# EAGLE design xhfc-breakout (EAGLE 7.7.0)
REVISION: v1

## Sheet 1 of 2
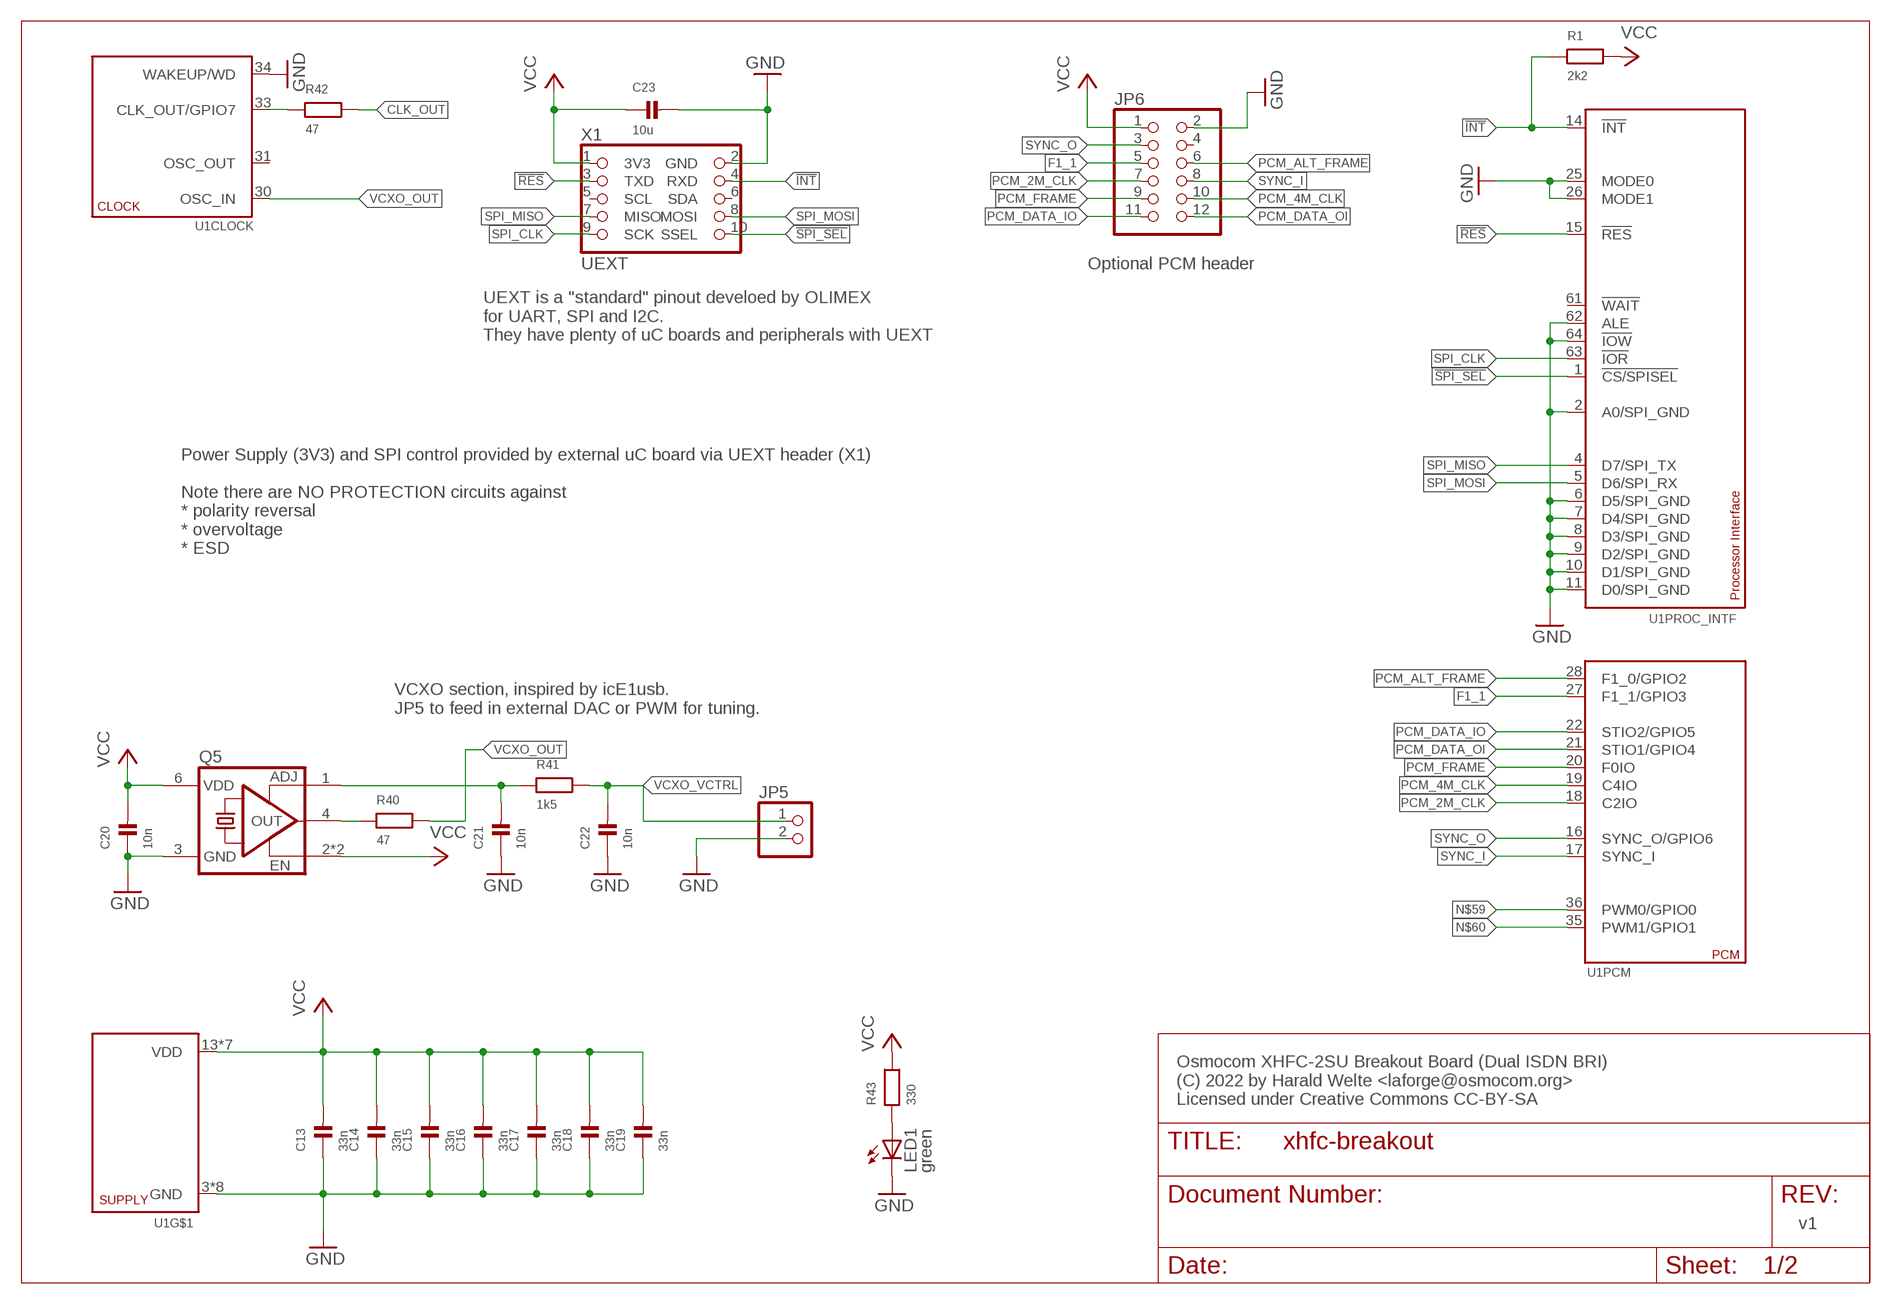
[diagram p0: schematic, sheet 1]

### Parts
C13  33n  CAP_CERAMIC_0603  [_0603]
C14  33n  CAP_CERAMIC_0603  [_0603]
C15  33n  CAP_CERAMIC_0603  [_0603]
C16  33n  CAP_CERAMIC_0603  [_0603]
C17  33n  CAP_CERAMIC_0603  [_0603]
C18  33n  CAP_CERAMIC_0603  [_0603]
C19  33n  CAP_CERAMIC_0603  [_0603]
C20  10n  CAP_CERAMIC_0603  [_0603]
C21  10n  CAP_CERAMIC_0603  [_0603]
C22  10n  CAP_CERAMIC_0603  [_0603]
C23  10u  CAP_CERAMIC1206  [1206]
JP5  PINHD-1X2  [1X02]
JP6  PINHD-2X6  [2X06]
LED1  green  LEDCHIP-LED0603  [CHIP-LED0603]
Q5  VCXO-EN-VKB  [VKB]
R1  2k2  RESISTOR_0603  [_0603]
R40  47  RESISTOR_0603  [_0603]
R41  1k5  RESISTOR_0603  [_0603]
R42  47  RESISTOR_0603  [_0603]
R43  330  RESISTOR_0603  [_0603]
U1  XHFC-2SU  [LQFP64]
X1  UEXT  [2X05]

### Nets
!INT: R1.1 U1.14(PROC_INTF:!INT) X1.4(RXD)
!RES: U1.15(PROC_INTF:!RES) X1.3(TXD)
!SPI_SEL: U1.1(PROC_INTF:!CS/SPISEL) X1.10(SSEL)
CLK_OUT: R42.2
F1_1: JP6.5 U1.27(PCM:F1_1/GPIO3)
GND: C13.1 C14.1 C15.1 C16.1 C17.1 C18.1 C19.1 C20.1 C21.1 C22.1 C23.2 JP5.2 JP6.2 LED1.C Q5.3(GND) U1.2(PROC_INTF:A0/SPI_GND) U1.3(GND) U1.6(PROC_INTF:D5/SPI_GND) U1.7(PROC_INTF:D4/SPI_GND) U1.8(PROC_INTF:D3/SPI_GND) U1.9(PROC_INTF:D2/SPI_GND) U1.10(PROC_INTF:D1/SPI_GND) U1.11(PROC_INTF:D0/SPI_GND) U1.12(GND) U1.23(GND) U1.25(PROC_INTF:MODE0) U1.26(PROC_INTF:MODE1) U1.32(GND) U1.34(CLOCK:WAKEUP/WD) U1.38(GND) U1.45(GND) U1.52(GND) U1.59(GND) U1.62(PROC_INTF:ALE) U1.64(PROC_INTF:!IOW) X1.2(GND) ; also sheet 2
N$2: LED1.A R43.1
N$59: U1.36(PCM:PWM0/GPIO0)
N$60: U1.35(PCM:PWM1/GPIO1)
N$62: C21.2 Q5.1(ADJ) R41.1
N$63: R42.1 U1.33(CLOCK:CLK_OUT/GPIO7)
N$64: Q5.4(OUT) R40.1
PCM_2M_CLK: JP6.7 U1.18(PCM:C2IO)
PCM_4M_CLK: JP6.10 U1.19(PCM:C4IO)
PCM_ALT_FRAME: JP6.6 U1.28(PCM:F1_0/GPIO2)
PCM_DATA_IO: JP6.11 U1.22(PCM:STIO2/GPIO5)
PCM_DATA_OI: JP6.12 U1.21(PCM:STIO1/GPIO4)
PCM_FRAME: JP6.9 U1.20(PCM:F0IO)
SPI_CLK: U1.63(PROC_INTF:!IOR) X1.9(SCK)
SPI_MISO: U1.4(PROC_INTF:D7/SPI_TX) X1.7(MISO)
SPI_MOSI: U1.5(PROC_INTF:D6/SPI_RX) X1.8(MOSI)
SYNC_I: JP6.8 U1.17(PCM:SYNC_I)
SYNC_O: JP6.3 U1.16(PCM:SYNC_O/GPIO6)
VCC: C13.2 C14.2 C15.2 C16.2 C17.2 C18.2 C19.2 C20.2 C23.1 JP6.1 Q5.2(EN) Q5.5(EN) Q5.6(VDD) R1.2 R43.2 U1.13(VDD) U1.24(VDD) U1.29(VDD) U1.37(VDD) U1.44(VDD) U1.53(VDD) U1.60(VDD) X1.1(3V3) ; also sheet 2
VCXO_OUT: R40.2 U1.30(CLOCK:OSC_IN)
VCXO_VCTRL: C22.2 JP5.1 R41.2
Unconnected: JP6.4 U1.31(CLOCK:OSC_OUT) U1.61(PROC_INTF:!WAIT) X1.5(SCL) X1.6(SDA)

### Notes on the sheet
- Optional PCM header
- UEXT is a "standard" pinout develoed by OLIMEX
  for UART, SPI and I2C.
  They have plenty of uC boards and peripherals with UEXT
- Power Supply (3V3) and SPI control provided by external uC board via UEXT header (X1)
  
  Note there are NO PROTECTION circuits against
  * polarity reversal
  * overvoltage
  * ESD
- VCXO section, inspired by icE1usb.
  JP5 to feed in external DAC or PWM for tuning.
- Osmocom XHFC-2SU Breakout Board (Dual ISDN BRI)
  (C) 2022 by Harald Welte <laforge@osmocom.org>
  Licensed under Creative Commons CC-BY-SA

## Sheet 2 of 2
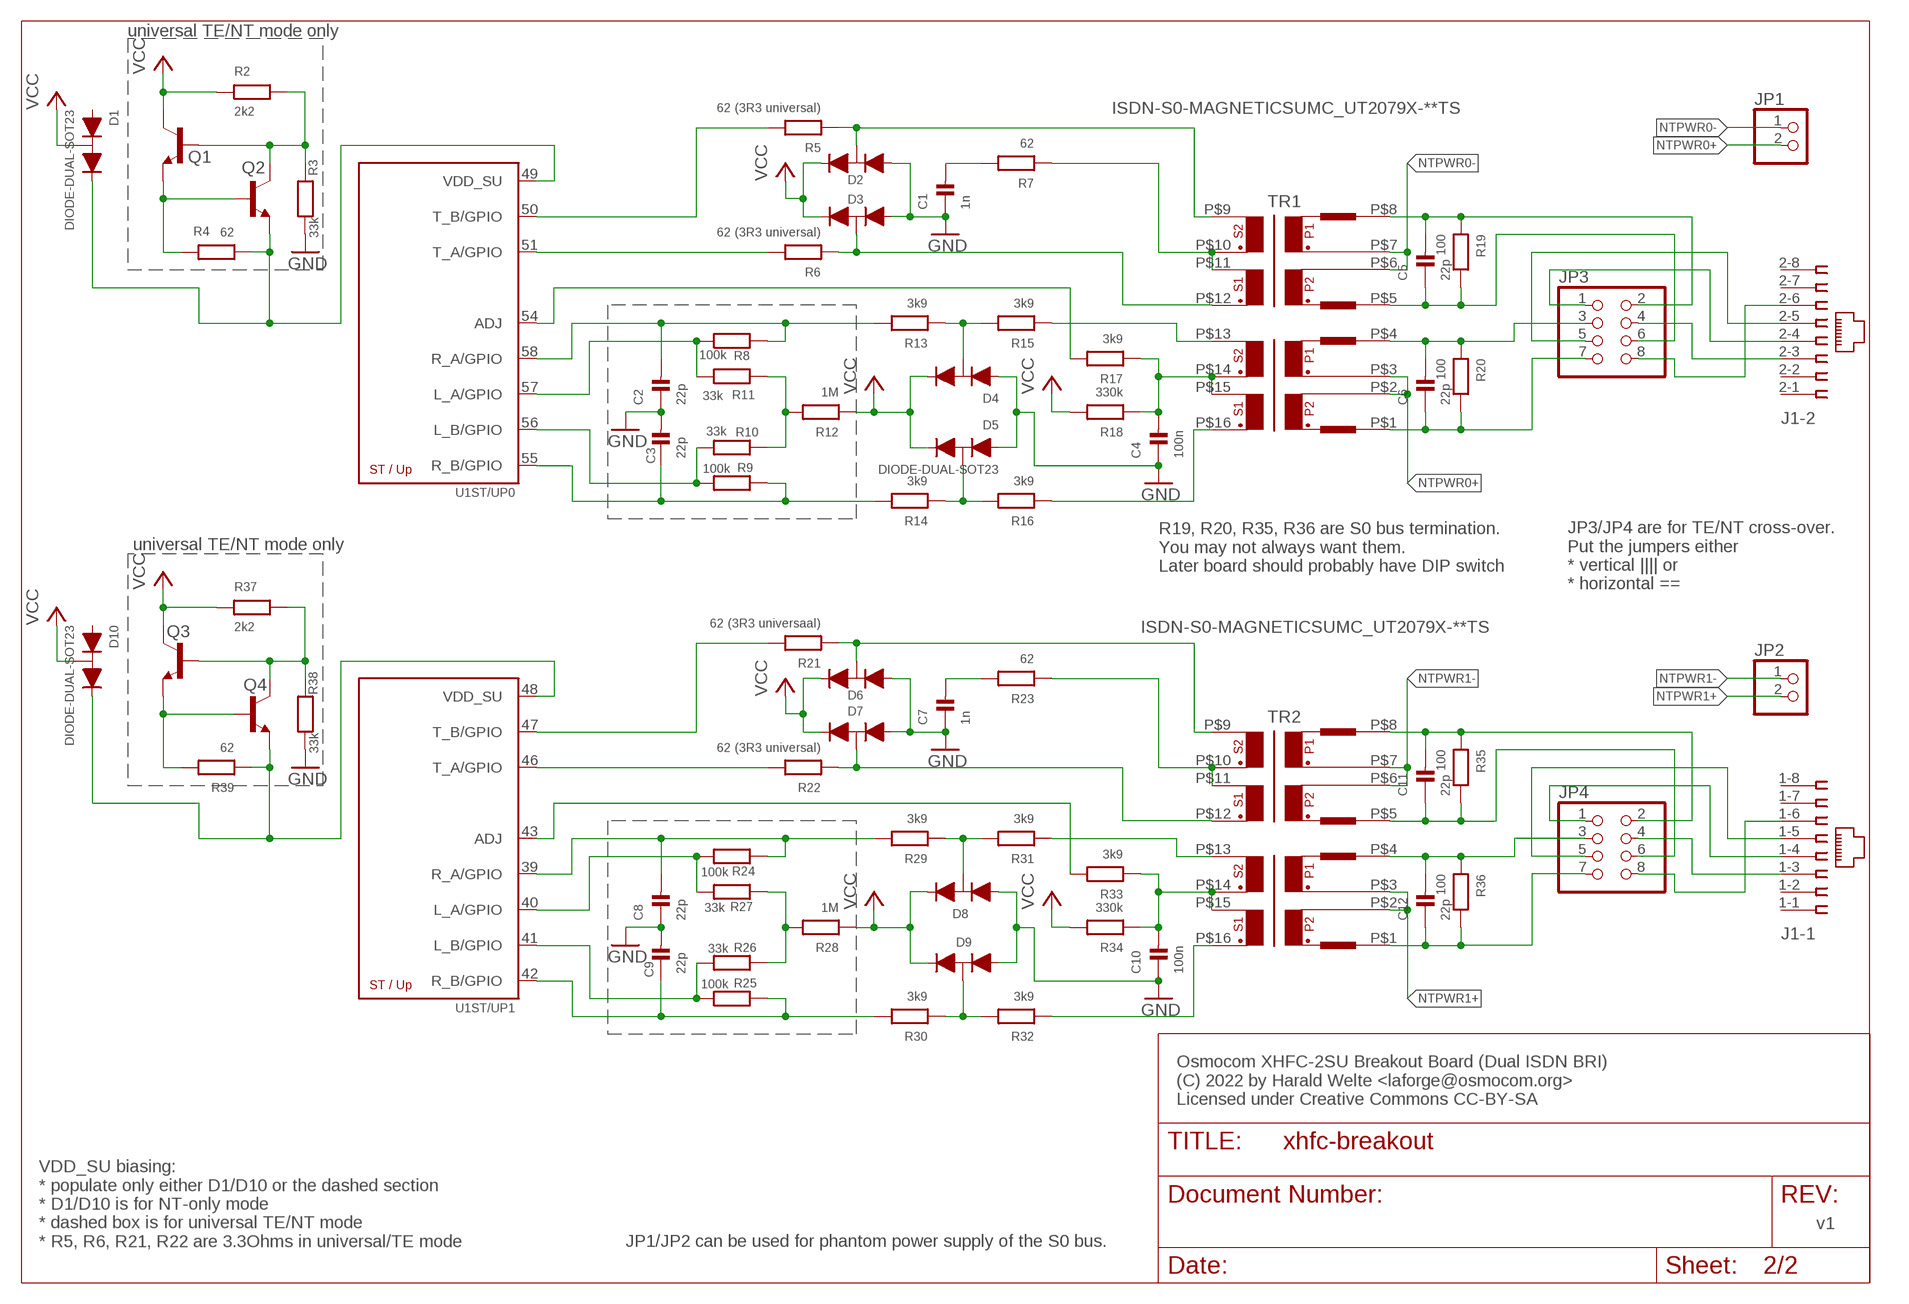
[diagram p1: schematic, sheet 2]

### Parts
C1  1n  CAP_CERAMIC_0603  [_0603]
C2  22p  CAP_CERAMIC_0603  [_0603]
C3  22p  CAP_CERAMIC_0603  [_0603]
C4  100n  CAP_CERAMIC_0603  [_0603]
C5  22p  CAP_CERAMIC_0603  [_0603]
C6  22p  CAP_CERAMIC_0603  [_0603]
C7  1n  CAP_CERAMIC_0603  [_0603]
C8  22p  CAP_CERAMIC_0603  [_0603]
C9  22p  CAP_CERAMIC_0603  [_0603]
C10  100n  CAP_CERAMIC_0603  [_0603]
C11  22p  CAP_CERAMIC_0603  [_0603]
C12  22p  CAP_CERAMIC_0603  [_0603]
D1  DIODE-DUAL-SOT23  [SOT23-3]
D2  DIODE-DUAL-SOT23  [SOT23-3]
D3  DIODE-DUAL-SOT23  [SOT23-3]
D4  DIODE-DUAL-SOT23  [SOT23-3]
D5  DIODE-DUAL-SOT23  [SOT23-3]
D6  DIODE-DUAL-SOT23  [SOT23-3]
D7  DIODE-DUAL-SOT23  [SOT23-3]
D8  DIODE-DUAL-SOT23  [SOT23-3]
D9  DIODE-DUAL-SOT23  [SOT23-3]
D10  DIODE-DUAL-SOT23  [SOT23-3]
J1  557560-1  [557560-1]
JP1  PINHD-1X2  [1X02]
JP2  PINHD-1X2  [1X02]
JP3  PINHD-2X4  [2X04]
JP4  PINHD-2X4  [2X04]
Q1  BC848CSMD  [SOT23]
Q2  BC848CSMD  [SOT23]
Q3  BC848CSMD  [SOT23]
Q4  BC848CSMD  [SOT23]
R2  2k2  RESISTOR_0603  [_0603]
R3  33k  RESISTOR_0603  [_0603]
R4  62  RESISTOR_0603  [_0603]
R5  62 (3R3 universal)  RESISTOR_0603  [_0603]
R6  62 (3R3 universal)  RESISTOR_0603  [_0603]
R7  62  RESISTOR_0603  [_0603]
R8  100k  RESISTOR_0603  [_0603]
R9  100k  RESISTOR_0603  [_0603]
R10  33k  RESISTOR_0603  [_0603]
R11  33k  RESISTOR_0603  [_0603]
R12  1M  RESISTOR_0603  [_0603]
R13  3k9  RESISTOR_0603  [_0603]
R14  3k9  RESISTOR_0603  [_0603]
R15  3k9  RESISTOR_0603  [_0603]
R16  3k9  RESISTOR_0603  [_0603]
R17  3k9  RESISTOR_0603  [_0603]
R18  330k  RESISTOR_0603  [_0603]
R19  100  RESISTOR_0603  [_0603]
R20  100  RESISTOR_0603  [_0603]
R21  62 (3R3 universaal)  RESISTOR_0603  [_0603]
R22  62 (3R3 universal)  RESISTOR_0603  [_0603]
R23  62  RESISTOR_0603  [_0603]
R24  100k  RESISTOR_0603  [_0603]
R25  100k  RESISTOR_0603  [_0603]
R26  33k  RESISTOR_0603  [_0603]
R27  33k  RESISTOR_0603  [_0603]
R28  1M  RESISTOR_0603  [_0603]
R29  3k9  RESISTOR_0603  [_0603]
R30  3k9  RESISTOR_0603  [_0603]
R31  3k9  RESISTOR_0603  [_0603]
R32  3k9  RESISTOR_0603  [_0603]
R33  3k9  RESISTOR_0603  [_0603]
R34  330k  RESISTOR_0603  [_0603]
R35  100  RESISTOR_0603  [_0603]
R36  100  RESISTOR_0603  [_0603]
R37  2k2  RESISTOR_0603  [_0603]
R38  33k  RESISTOR_0603  [_0603]
R39  62  RESISTOR_0603  [_0603]
TR1  ISDN-S0-MAGNETICSUMC_UT2079X-**TS  [UMEC_UT207]
TR2  ISDN-S0-MAGNETICSUMC_UT2079X-**TS  [UMEC_UT207]

### Nets
GND: C1.1 C2.1 C3.2 C4.1 C7.1 C8.1 C9.2 C10.1 D2.1(A) D3.1(A) D4.1(A) D5.1(A) D6.1(A) D7.1(A) D8.1(A) D9.1(A) R3.1 R38.1 ; also sheet 1
N$1: Q1.1(B) Q2.3(C) R2.2 R3.2
N$3: Q1.2(E) Q2.1(B) R4.2
N$6: D2.3(M) R5.1 TR1.P$9
N$7: D3.3(M) R6.1 TR1.P$12
N$8: J1.2-4 JP3.1
N$9: C1.2 R7.2
N$10: R7.1 TR1.P$10 TR1.P$11
N$16: R10.1 R11.1 R12.2
N$17: D6.3(M) R21.1 TR2.P$9
N$18: C5.2 JP3.2 R19.1 TR1.P$8
N$19: D4.3(M) R13.1 R15.2
N$20: D5.3(M) R14.1 R16.2
N$21: C5.1 JP3.6 R19.2 TR1.P$5
N$22: R15.1 TR1.P$13
N$23: R16.1 TR1.P$16
N$24: C4.2 R17.1 R18.1 TR1.P$14 TR1.P$15
N$25: J1.2-5 JP3.5
N$26: C6.1 JP3.7 R20.2 TR1.P$1
N$27: D7.3(M) R22.1 TR2.P$12
N$30: C7.2 R23.2
N$31: R23.1 TR2.P$10 TR2.P$11
N$37: R26.1 R27.1 R28.2
N$38: D8.3(M) R29.1 R31.2
N$39: D9.3(M) R30.1 R32.2
N$40: R31.1 TR2.P$13
N$41: R32.1 TR2.P$16
N$42: C10.2 R33.1 R34.1 TR2.P$14 TR2.P$15
N$43: C11.2 JP4.2 R35.1 TR2.P$8
N$44: C11.1 JP4.6 R35.2 TR2.P$5
N$45: C12.2 JP4.3 R36.1 TR2.P$4
N$46: C12.1 JP4.7 R36.2 TR2.P$1
N$47: Q3.1(B) Q4.3(C) R37.2 R38.2
N$48: Q3.2(E) Q4.1(B) R39.2
N$50: C6.2 JP3.3 R20.1 TR1.P$4
N$52: J1.2-3 JP3.4
N$53: J1.2-6 JP3.8
N$54: J1.1-4 JP4.1
N$55: J1.1-5 JP4.5
N$56: J1.1-3 JP4.4
N$61: J1.1-6 JP4.8
NTPWR0+: JP1.2 TR1.P$2 TR1.P$3
NTPWR0-: JP1.1 TR1.P$6 TR1.P$7
NTPWR1+: JP2.2 TR2.P$2 TR2.P$3
NTPWR1-: JP2.1 TR2.P$6 TR2.P$7
P0_ADJ: R17.2 U1.54(ST/UP0:ADJ)
P0_L_A: R8.2 R11.2 U1.57(ST/UP0:L_A/GPIO)
P0_L_B: R9.2 R10.2 U1.56(ST/UP0:L_B/GPIO)
P0_R_A: C2.2 R8.1 R13.2 U1.58(ST/UP0:R_A/GPIO)
P0_R_B: C3.1 R9.1 R14.2 U1.55(ST/UP0:R_B/GPIO)
P0_T_A: R6.2 U1.51(ST/UP0:T_A/GPIO)
P0_T_B: R5.2 U1.50(ST/UP0:T_B/GPIO)
P0_VDD_SU: D1.2(C) Q2.2(E) R4.1 U1.49(ST/UP0:VDD_SU)
P1_ADJ: R33.2 U1.43(ST/UP1:ADJ)
P1_L_A: R24.2 R27.2 U1.40(ST/UP1:L_A/GPIO)
P1_L_B: R25.2 R26.2 U1.41(ST/UP1:L_B/GPIO)
P1_R_A: C8.2 R24.1 R29.2 U1.39(ST/UP1:R_A/GPIO)
P1_R_B: C9.1 R25.1 R30.2 U1.42(ST/UP1:R_B/GPIO)
P1_T_A: R22.2 U1.46(ST/UP1:T_A/GPIO)
P1_T_B: R21.2 U1.47(ST/UP1:T_B/GPIO)
P1_VDD_SU: D10.2(C) Q4.2(E) R39.1 U1.48(ST/UP1:VDD_SU)
VCC: D1.3(M) D2.2(C) D3.2(C) D4.2(C) D5.2(C) D6.2(C) D7.2(C) D8.2(C) D9.2(C) D10.3(M) Q1.3(C) Q3.3(C) R2.1 R12.1 R18.2 R28.1 R34.2 R37.1 ; also sheet 1
Unconnected: D1.1(A) D10.1(A) J1.1-1 J1.1-2 J1.1-7 J1.1-8 J1.2-1 J1.2-2 J1.2-7 J1.2-8

### Notes on the sheet
- universal TE/NT mode only
- universal TE/NT mode only
- R19, R20, R35, R36 are S0 bus termination.
  You may not always want them.
  Later board should probably have DIP switch
- JP3/JP4 are for TE/NT cross-over.
  Put the jumpers either
  * vertical |||| or
  * horizontal ==
- Osmocom XHFC-2SU Breakout Board (Dual ISDN BRI)
  (C) 2022 by Harald Welte <laforge@osmocom.org>
  Licensed under Creative Commons CC-BY-SA
- VDD_SU biasing:
  * populate only either D1/D10 or the dashed section
  * D1/D10 is for NT-only mode
  * dashed box is for universal TE/NT mode
  * R5, R6, R21, R22 are 3.3Ohms in universal/TE mode
- JP1/JP2 can be used for phantom power supply of the S0 bus.

## Library data of the parts
C1-C23 = rc-sysmocom:CAP_CERAMIC: Ceramic Capacitors 0402 - 0402 Surface Mount Capacitors 16pF 50V 5% [Digikey: 445-4899-2-ND] 18pF 50V 5% [Digikey: 490-1281-2-ND] 22pF 50V 5% [Digikey: 490-1283-2-ND] 68pF 50V 5% [Digikey: 490-1289-2-ND] 0.1uF 10V 10% [Digikey: 490-1318-2-ND] 1.0uF 6.3V 10% [Digikey: 490-1320-2-ND] 0603 - 0603 Surface Mount Capacitors 16 pF 50V 5% [Digikey: 445-5051-2-ND] 22 pF 50V [Digikey: PCC220ACVTR-ND] 33 pF 50V 5% [Digikey: 490-1415-1-ND] 56pF 50V 5% [Digikey: 490-1421-1-ND] 220pF 50V 5% [Digikey: 445-1285-1-ND] 680 pF 50V 2200 pF 50V 5% C0G [Digikey: 445-1297-1-ND] 5600 pF 100V 5% X7R [Digikey: 478-3711-1-ND] 0.1 µF 25V 10% [Digikey: PCC2277TR-ND] 0.22 µF 16V 10% X7R [Digikey: 445-1318-1-ND] 1.0 µF 25V 10% [Digikey: 445-5146-2-ND] 0603 - RF Specific 3pF 250V +/-0.1pF RF [Digikey: 712-1347-1-ND] 18 pF 250V 5% [Digikey: 478-3505-1-ND or 712-1322-1-ND] 56 pF 250V 5% C0G RF [Digikey: 490-4867-1-ND] 68 pF 250V RF [Digikey: 490-4868-1-ND] 0805 - 0805 Surface Mount Capacitors 220 pF 250V 2% RF Ceramic Capacitor [Digikey: 712-1398-1-ND] 1000 pF 50V 2% NP0 Ceramic Capacitor [Digikey: 478-3760-1-ND] 0.1 µF 25V 10% Ceramic Capacitor [Digikey: PCC1828TR-ND] 1.0 µF 16V 10% Ceramic Capacitor[Digikey: 490-1691-2-ND] 10.0 µF 10V 10% Ceramic Capacitor[Digikey: 709-1228-1-ND] 10.0 uF 16V 10% Ceramic Capacitor [Digikey: 478-5165-2-ND] 47 uF 6.3V 20% Ceramic Capacitor [Digikey: 587-1779-1-ND or 399-5506-1-ND] 1206 - 1206 Surface Mount Capacitors 47uF 10V 20% Ceramic Capacitor [Digikey: 490-5528-1-ND or 399-5508-1-ND or 445-6010-1-ND] 100uF 6.3V -20%, +80% Y5V Ceramic Capacitor (Digikey: 490-4512-1-ND, Mouser: 81-GRM31CF50J107ZE1L) 1810 - 1810 Surface Mount Capacitors High volt MLC; no solder stop between for higher isolation; CLASS: CAPACITOR; DESCRIPTION: NO DESCRIPTION; LINK: UNKNOWN LINK; MANUFACTURER: UNKNOWN MANUFACTURER; MANUFACTURERPARTNUMBER: UNKNOWN MANUFACTURER PART NUMBER; POPULATED: TRUE; ROHSCERTIFICATE: UNKNOWN ROHS CERTIFICATE; SOURCE: UNKNOWN SOURCE; SOURCEPARTNUMBER: UNKNOWN SOURCE PART NUMBER
D1-D10 = diodes-sysmocom:DIODE-DUAL; CLASS: DIODE; DATASHEET: https://assets.nexperia.com/documents/data-sheet/BAV99_SER.pdf; DESCRIPTION: DIODE ARRAY GP 100V 150MA SOT323; LINK: https://www.digikey.com/en/products/detail/nexperia-usa-inc/BAV99W-115/763229; MANUFACTURER: Nexperia USA Inc.; MANUFACTURERPARTNUMBER: BAV99W,115; POPULATED: TRUE; ROHSCERTIFICATE: ROHS3 Compliant; SOURCE: DIGIKEY; SOURCEPARTNUMBER: 1727-2915-6-ND
J1 = con-amp:557560-1: AMP connector; CLASS: CONNECTOR\JUMPER; DATASHEET: https://www.te.com/commerce/DocumentDelivery/DDEController?Action=srchrtrv&DocNm=5557560&DocType=Customer+Drawing&DocLang=English; DESCRIPTION: CONN MOD JACK 8P8C R/A UNSHLD; LINK: https://www.digikey.com/en/products/detail/te-connectivity-amp-connectors/5557560-1/769593; MANUFACTURER: TE Connectivity AMP Connectors; MANUFACTURERPARTNUMBER: 5557560-1; POPULATED: TRUE; ROHSCERTIFICATE: RoHS Compliant; SOURCE: DIGIKEY; SOURCEPARTNUMBER: A31449-ND
JP1 JP2 JP5 = laforge:PINHD-1X2: PIN HEADER; CLASS: CONNECTOR\JUMPER; DESCRIPTION: NO DESCRIPTION; LINK: UNKNOWN LINK; MANUFACTURER: UNKNOWN MANUFACTURER; MANUFACTURERPARTNUMBER: UNKNOWN MANUFACTURER PART NUMBER; POPULATED: TRUE; ROHSCERTIFICATE: UNKNOWN ROHS CERTIFICATE; SOURCE: UNKNOWN SOURCE; SOURCEPARTNUMBER: UNKNOWN SOURCE PART NUMBER
JP3 JP4 = pinhead:PINHD-2X4: PIN HEADER; CLASS: CONNECTOR\JUMPER; DESCRIPTION: NO DESCRIPTION; LINK: UNKNOWN LINK; MANUFACTURER: UNKNOWN MANUFACTURER; MANUFACTURERPARTNUMBER: UNKNOWN MANUFACTURER PART NUMBER; POPULATED: TRUE; ROHSCERTIFICATE: UNKNOWN ROHS CERTIFICATE; SOURCE: UNKNOWN SOURCE; SOURCEPARTNUMBER: UNKNOWN SOURCE PART NUMBER
JP6 = pinhead:PINHD-2X6: PIN HEADER; CLASS: CONNECTOR\JUMPER; DESCRIPTION: NO DESCRIPTION; LINK: UNKNOWN LINK; MANUFACTURER: UNKNOWN MANUFACTURER; MANUFACTURERPARTNUMBER: UNKNOWN MANUFACTURER PART NUMBER; POPULATED: TRUE; ROHSCERTIFICATE: UNKNOWN ROHS CERTIFICATE; SOURCE: UNKNOWN SOURCE; SOURCEPARTNUMBER: UNKNOWN SOURCE PART NUMBER
LED1 = led:LED: LED OSRAM: - CHIPLED LG R971, LG N971, LY N971, LG Q971, LY Q971, LO R971, LY R971 LH N974, LH R974 LS Q976, LO Q976, LY Q976 LO Q996 - Hyper CHIPLED LW Q18S LB Q993, LB Q99A, LB R99A - SideLED LS A670, LO A670, LY A670, LG A670, LP A670 LB A673, LV A673, LT A673, LW A673 LH A674 LY A675 LS A676, LA A676, LO A676, LY A676, LW A676 LS A679, LY A679, LG A679 - Hyper Micro SIDELED® LS Y876, LA Y876, LO Y876, LY Y876 LT Y87S - SmartLED LW L88C, LW L88S LB L89C, LB L89S, LG L890 LS L89K, LO L89K, LY L89K LS L896, LA L896, LO L896, LY L896 - TOPLED LS T670, LO T670, LY T670, LG T670, LP T670 LSG T670, LSP T670, LSY T670, LOP T670, LYG T670 LG T671, LOG T671, LSG T671 LB T673, LV T673, LT T673, LW T673 LH T674 LS T676, LA T676, LO T676, LY T676, LB T676, LH T676, LSB T676, LW T676 LB T67C, LV T67C, LT T67C, LS T67K, LO T67K, LY T67K, LW E67C LS E67B, LA E67B, LO E67B, LY E67B, LB E67C, LV E67C, LT E67C LW T67C LS T679, LY T679, LG T679 LS T770, LO T770, LY T770, LG T770, LP T770 LB T773, LV T773, LT T773, LW T773 LH T774 LS E675, LA E675, LY E675, LS T675 LS T776, LA T776, LO T776, LY T776, LB T776 LHGB T686 LT T68C, LB T68C - Hyper Mini TOPLED® LB M676 - Mini TOPLED Santana® LG M470 LS M47K, LO M47K, LY M47K Source: http://www.osram.convergy.de LUXEON: - LUMILED® LXK2-PW12-R00, LXK2-PW12-S00, LXK2-PW14-U00, LXK2-PW14-V00 LXK2-PM12-R00, LXK2-PM12-S00, LXK2-PM14-U00 LXK2-PE12-Q00, LXK2-PE12-R00, LXK2-PE12-S00, LXK2-PE14-T00, LXK2-PE14-U00 LXK2-PB12-K00, LXK2-PB12-L00, LXK2-PB12-M00, LXK2-PB14-N00, LXK2-PB14-P00, LXK2-PB14-Q00 LXK2-PR12-L00, LXK2-PR12-M00, LXK2-PR14-Q00, LXK2-PR14-R00 LXK2-PD12-Q00, LXK2-PD12-R00, LXK2-PD12-S00 LXK2-PH12-R00, LXK2-PH12-S00 LXK2-PL12-P00, LXK2-PL12-Q00, LXK2-PL12-R00 Source: www.luxeon.com KINGBRIGHT: KA-3528ASYC Source: www.kingbright.com; CLASS: LED; DESCRIPTION: NO DESCRIPTION; LINK: UNKNOWN LINK; MANUFACTURER: UNKNOWN MANUFACTURER; MANUFACTURERPARTNUMBER: UNKNOWN MANUFACTURER PART NUMBER; POPULATED: TRUE; ROHSCERTIFICATE: UNKNOWN ROHS CERTIFICATE; SOURCE: UNKNOWN SOURCE; SOURCEPARTNUMBER: UNKNOWN SOURCE PART NUMBER
Q1-Q4 = transistor-npn:BC848*: NPN Transistor; CLASS: TRANSISTOR\MOSFET; DATASHEET: https://www.onsemi.com/pdf/datasheet/bc846awt1-d.pdf; DESCRIPTION: TRANS NPN 30V 100MA SC70-3; LINK: https://www.digikey.com/en/products/detail/onsemi/BC848CWT1G/1476045; MANUFACTURER: onsemi; MANUFACTURERPARTNUMBER: BC848CWT1G; POPULATED: TRUE; ROHSCERTIFICATE: ROHS3 Compliant; SOURCE: DIGIKEY; SOURCEPARTNUMBER: BC848CWT1GOSDKR-ND
Q5 = tcxo:VCXO-EN: VCXO with Enable pin; CLASS: TRANSISTOR\MOSFET; DATASHEET: https://www.conwin.com/datasheets/vx/vx604.pdf; DESCRIPTION: XTAL OSC VCXO 24.5760MHZ LVCMOS; LINK: https://www.digikey.com/en/products/detail/connor-winfield/VKB51B2-024-576M/7927885; MANUFACTURER: Connor Winfield; MANUFACTURERPARTNUMBER: VKB51B2-024.576M; POPULATED: TRUE; ROHSCERTIFICATE: ROHS3 Compliant; SOURCE: DIGIKEY; SOURCEPARTNUMBER: CW967CT-ND
R1-R43 = rc-sysmocom:RESISTOR: Resistors 0402 - 0402 Surface Mount Package 22 Ohm 1% 1/16W [Digikey: 311-22.0LRTR-ND] 33 Ohm 5% 1/16W 1.0K 5% 1/16W 1.5K 5% 1/16W 2.0K 1% 1/16W 10.0K 1% 1/16W [Digikey: 311-10.0KLRTR-ND] 10.0K 5% 1/16W [Digikey: RMCF0402JT10K0TR-ND] 12.1K 1% 1/16W [Digikey: 311-22.0LRTR-ND] 100.0K 5% 1/16W 0603 - 0603 Surface Mount Package 1/10 Watt 0805 - 0805 Surface Mount Package 1/8 Watt 1206 - 1206 Surface Mount Package 2012 - 2010 Surface Mount Package 0.11 Ohm 1/2 Watt 1% Resistor - Digikey: RHM.11UCT-ND; CLASS: RESISTOR; DESCRIPTION: NO DESCRIPTION; LINK: UNKNOWN LINK; MANUFACTURER: UNKNOWN MANUFACTURER; MANUFACTURERPARTNUMBER: UNKNOWN MANUFACTURER PART NUMBER; POPULATED: TRUE; ROHSCERTIFICATE: UNKNOWN ROHS CERTIFICATE; SOURCE: UNKNOWN SOURCE; SOURCEPARTNUMBER: UNKNOWN SOURCE PART NUMBER
TR1 TR2 = isdn-magnetics:ISDN-S0-MAGNETICS; CLASS: UNKNOWN CLASS; DESCRIPTION: NO DESCRIPTION; LINK: UNKNOWN LINK; MANUFACTURER: UMEC; MANUFACTURERPARTNUMBER: UT20795-5MTS; POPULATED: TRUE; ROHSCERTIFICATE: UNKNOWN ROHS CERTIFICATE; SOURCE: UMEC; SOURCEPARTNUMBER: UNKNOWN SOURCE PART NUMBER
U1 = xhfc:XHFC-2SU; CLASS: IC; DESCRIPTION: NO DESCRIPTION; LINK: UNKNOWN LINK; MANUFACTURER: UNKNOWN MANUFACTURER; MANUFACTURERPARTNUMBER: XHFC-2SU; POPULATED: TRUE; ROHSCERTIFICATE: UNKNOWN ROHS CERTIFICATE; SOURCE: CologneChip; SOURCEPARTNUMBER: UNKNOWN SOURCE PART NUMBER
X1 = laforge:UEXT: UEXT header as used by lots of Olimex designs; CLASS: CONNECTOR; DESCRIPTION: NO DESCRIPTION; LINK: UNKNOWN LINK; MANUFACTURER: UNKNOWN MANUFACTURER; MANUFACTURERPARTNUMBER: UNKNOWN MANUFACTURER PART NUMBER; POPULATED: TRUE; ROHSCERTIFICATE: UNKNOWN ROHS CERTIFICATE; SOURCE: UNKNOWN SOURCE; SOURCEPARTNUMBER: UNKNOWN SOURCE PART NUMBER

## Board
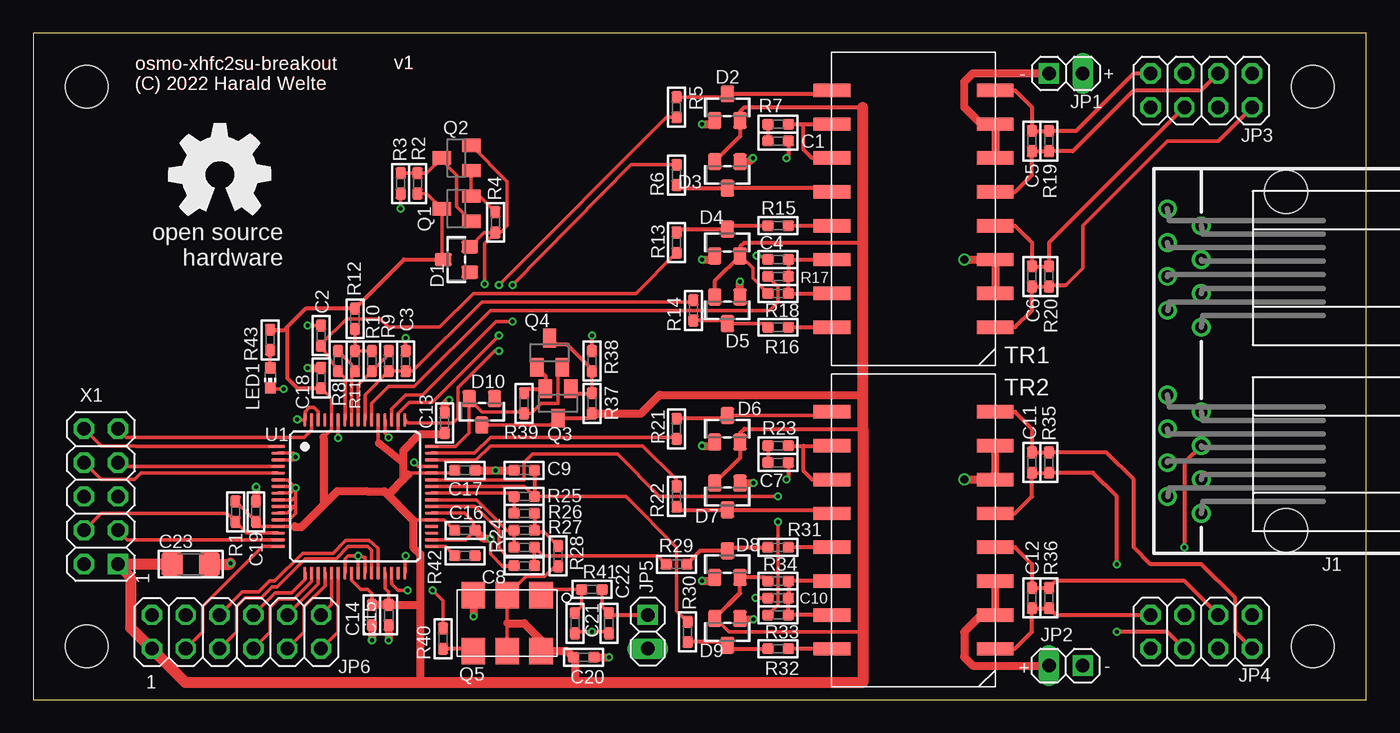
[diagram p2: board, top side]
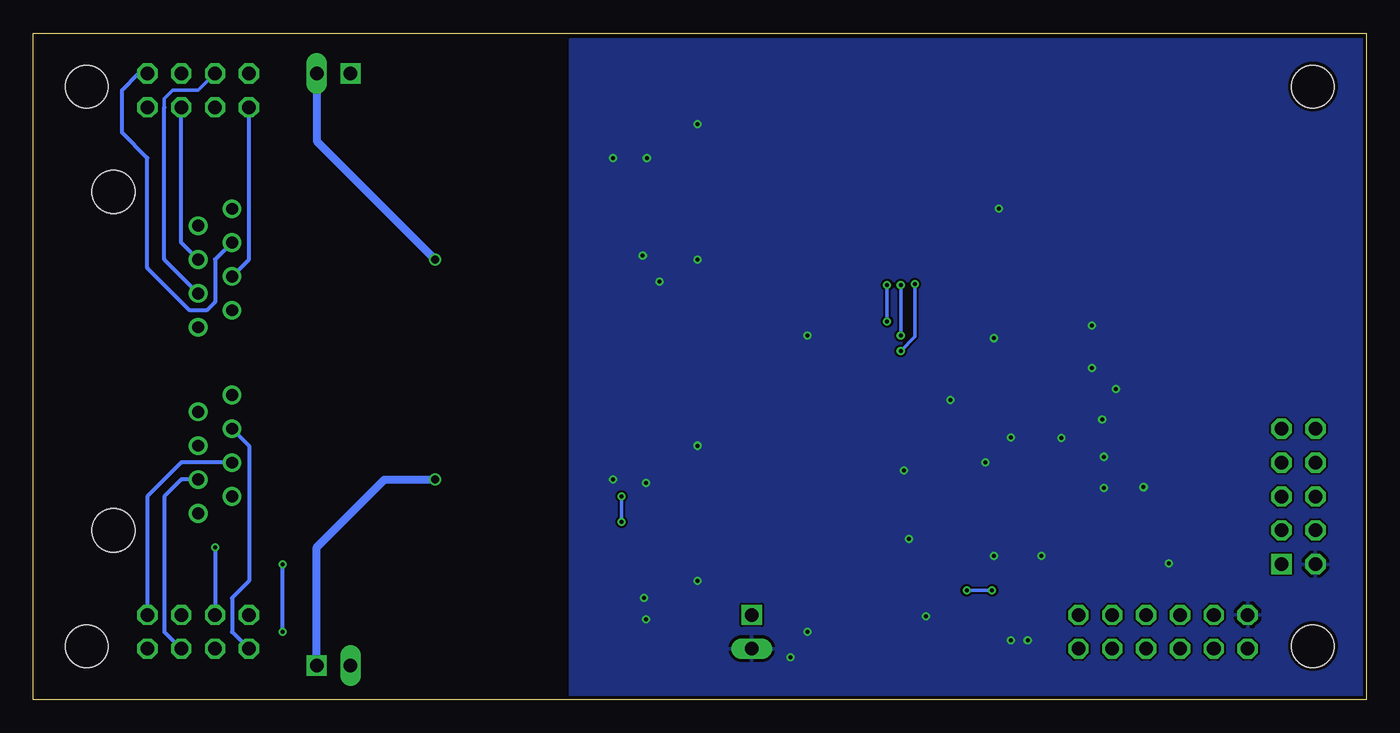
[diagram p3: board, bottom side, seen from below]

Size 100 x 50 mm. Coordinates in mm from the lower left corner, seen from the top.
Outline: 0,0 100,0 100,50 0,50 0,0
Copper layers (1*16): Top 0.035mm / dielectric 1.5mm / Bottom 0.035mm
Design rules "SeeedStudio_2layer_DRU_no_angle_20140221": minimum track width 6mil, minimum drill 12mil, track to track 6mil, track to pad 6mil, pad to pad 6mil, via to via 6mil, smd to smd 0mil, copper to edge 10mil, drill to drill 10mil, minimum pad ring 10mil, minimum via ring 6mil, stop-mask expansion 2mil, vias tented up to drill 100mil, thermal gap 10mil
Holes 3.2 mm at 96,46 96,4 4,4 4,46

### Footprints (pad centres in the part's own frame; a part is rotated, then mirrored left to right if it is on the bottom)
_0603 = smd 0.9 x 0.8: 1 -0.762,0; 2 0.762,0
1206 = smd 1.6 x 1.8: 1 -1.4,0; 2 1.4,0
SOT23-3 = smd 1 x 1.27: 1 -0.95,-1; 2 0.95,-1; 3 0,1
557560-1 = drill 0.889: 1-1 -11.43,6.35; 1-2 -10.16,8.89; 1-3 -8.89,6.35; 1-4 -7.62,8.89; 1-5 -6.35,6.35; 1-6 -5.08,8.89; 1-7 -3.81,6.35; 1-8 -2.54,8.89; 2-1 2.54,6.35; 2-2 3.81,8.89; 2-3 5.08,6.35; 2-4 6.35,8.89; 2-5 7.62,6.35; 2-6 8.89,8.89; 2-7 10.16,6.35; 2-8 11.43,8.89 | hole 3.251: -12.7,0; 12.7,0
1X02 = drill 1.016 square: 1 -1.27,0 | drill 1.016 long: 2 1.27,0
2X04 = drill 1.016 octagon: 1 -3.81,-1.27; 2 -3.81,1.27; 3 -1.27,-1.27; 4 -1.27,1.27; 5 1.27,-1.27; 6 1.27,1.27; 7 3.81,-1.27; 8 3.81,1.27
2X06 = drill 1.016 octagon: 1 -6.35,-1.27; 2 -6.35,1.27; 3 -3.81,-1.27; 4 -3.81,1.27; 5 -1.27,-1.27; 6 -1.27,1.27; 7 1.27,-1.27; 8 1.27,1.27; 9 3.81,-1.27; 10 3.81,1.27; 11 6.35,-1.27; 12 6.35,1.27
CHIP-LED0603 = smd 0.8 x 0.8: A 0,-0.75; C 0,0.75
SOT23 = smd 1 x 1.4: 1 -0.95,-1.1; 2 0.95,-1.1; 3 0,1.1
VKB = smd 1.78 x 2: 1 -2.54,-2.1; 2 0,-2.1; 3 2.54,-2.1; 4 2.54,2.1; 5 0,2.1; 6 -2.54,2.1
UMEC_UT207 = smd 1 x 2.75: P$1 -8.89,-6.125; P$2 -6.35,-6.125; P$3 -3.81,-6.125; P$4 -1.27,-6.125; P$5 1.27,-6.125; P$6 3.81,-6.125; P$7 6.35,-6.125; P$8 8.89,-6.125; P$9 8.89,6.125; P$10 6.35,6.125; P$11 3.81,6.125; P$12 1.27,6.125; P$13 -1.27,6.125; P$14 -3.81,6.125; P$15 -6.35,6.125; P$16 -8.89,6.125
LQFP64 = smd 0.25 x 1.2: 1 -3.75,-5.85 | smd 0.25 x 1: 2 -3.25,-5.75; 3 -2.75,-5.75; 4 -2.25,-5.75; 5 -1.75,-5.75; 6 -1.25,-5.75; 7 -0.75,-5.75; 8 -0.25,-5.75; 9 0.25,-5.75; 10 0.75,-5.75; 11 1.25,-5.75; 12 1.75,-5.75; 13 2.25,-5.75; 14 2.75,-5.75; 15 3.25,-5.75; 16 3.75,-5.75; 33 3.75,5.75; 34 3.25,5.75; 35 2.75,5.75; 36 2.25,5.75; 37 1.75,5.75; 38 1.25,5.75; 39 0.75,5.75; 40 0.25,5.75; 41 -0.25,5.75; 42 -0.75,5.75; 43 -1.25,5.75; 44 -1.75,5.75; 45 -2.25,5.75; 46 -2.75,5.75; 47 -3.25,5.75; 48 -3.75,5.75 | smd 1 x 0.25: 17 5.75,-3.75; 18 5.75,-3.25; 19 5.75,-2.75; 20 5.75,-2.25; 21 5.75,-1.75; 22 5.75,-1.25; 23 5.75,-0.75; 24 5.75,-0.25; 25 5.75,0.25; 26 5.75,0.75; 27 5.75,1.25; 28 5.75,1.75; 29 5.75,2.25; 30 5.75,2.75; 31 5.75,3.25; 32 5.75,3.75; 49 -5.75,3.75; 50 -5.75,3.25; 51 -5.75,2.75; 52 -5.75,2.25; 53 -5.75,1.75; 54 -5.75,1.25; 55 -5.75,0.75; 56 -5.75,0.25; 57 -5.75,-0.25; 58 -5.75,-0.75; 59 -5.75,-1.25; 60 -5.75,-1.75; 61 -5.75,-2.25; 62 -5.75,-2.75; 63 -5.75,-3.25; 64 -5.75,-3.75
2X05 = drill 1.016 square: 1 -5.08,-1.27 | drill 1.016 octagon: 2 -5.08,1.27; 3 -2.54,-1.27; 4 -2.54,1.27; 5 0,-1.27; 6 0,1.27; 7 2.54,-1.27; 8 2.54,1.27; 9 5.08,-1.27; 10 5.08,1.27

### Placement (x,y rotation side)
C1  55.88,41.91 180 top
C2  21.59,27.3 270 top
C3  27.94,25.4 90 top
C4  55.88,33.02 0 top
C5  74.93,41.91 90 top
C6  74.93,31.75 90 top
C7  55.88,17.78 180 top
C8  36.83,10.03 0 top
C9  36.83,17.21 180 top
C10  55.88,7.62 0 top
C11  74.93,17.78 90 top
C12  74.93,7.62 90 top
C13  30.86,20.76 270 top
C14  25.4,6.35 90 top
C15  26.67,6.35 90 top
C16  32.38,12.7 180 top
C17  32.38,17.21 180 top
C18  21.59,24.13 270 top
C19  16.7,14.1 270 top
C20  41.29,3.17 180 top
C21  40.64,5.73 90 top
C22  43.18,5.73 90 top
C23  11.81,10.16 0 top
D1  31.75,33.02 90 top
D2  52.07,44.45 0 top
D3  52.07,39.37 180 top
D4  52.07,34.29 0 top
D5  52.07,29.21 180 top
D6  52.07,20.32 0 top
D7  52.07,15.24 180 top
D8  52.07,10.16 0 top
D9  52.07,5.08 180 top
D10  33.66,21.59 180 top
J1  93.98,25.4 90 top
JP1  77.47,46.99 0 top
JP2  77.47,2.54 180 top
JP3  87.63,45.72 0 top
JP4  87.63,5.08 180 top
JP5  46.1,5.08 270 top
JP6  15.24,5.08 0 top
LED1  17.78,24.13 180 top
Q1  31.75,36.83 90 top
Q2  31.75,40.64 90 top
Q3  39.37,22.23 180 top
Q4  38.73,26.04 0 top
Q5  35.56,5.73 180 top
R1  15.18,14.1 90 top
R2  28.83,38.73 90 top
R3  27.56,38.73 90 top
R4  34.67,35.81 90 top
R5  48.26,44.45 270 top
R6  48.26,39.37 90 top
R7  55.88,43.18 180 top
R8  22.86,25.4 90 top
R9  26.67,25.4 90 top
R10  25.4,25.4 270 top
R11  24.13,25.4 270 top
R12  24.13,28.57 270 top
R13  48.26,34.29 270 top
R14  49.53,29.21 90 top
R15  55.88,35.56 180 top
R16  55.88,27.94 180 top
R17  55.88,31.75 180 top
R18  55.88,30.48 180 top
R19  76.2,41.91 270 top
R20  76.2,31.75 270 top
R21  48.26,20.32 270 top
R22  48.26,15.24 90 top
R23  55.88,19.05 180 top
R24  36.83,11.43 180 top
R25  36.83,15.24 180 top
R26  36.83,13.97 180 top
R27  36.83,12.7 180 top
R28  39.37,10.76 90 top
R29  48.26,10.16 180 top
R30  49.09,5.08 90 top
R31  55.88,11.43 180 top
R32  55.88,3.81 180 top
R33  55.88,6.35 180 top
R34  55.88,8.89 180 top
R35  76.2,17.78 270 top
R36  76.2,7.62 270 top
R37  41.91,22.23 90 top
R38  41.91,25.4 270 top
R39  36.83,22.23 90 top
R40  30.74,4.57 90 top
R41  41.91,8.27 0 top
R42  32.38,10.79 0 top
R43  17.78,26.99 90 top
TR1  66.04,36.83 90 top
TR2  66.04,12.7 90 top
U1  24.13,15.24 270 top
U$1  [OSHW_8MM_COPPER]  13.97,39.37 0 top
U$2  [OSHW_8MM]  13.97,39.37 0 top
X1  5.08,15.24 90 top

### Tracks (layer width: path | path; a pad name or v marks a point on that pad's centre or on a via)
!INT
  Top 0.254: X1.4 5.08,13.97 14.54,13.97 R1.1 16.02,12.49 U1.14
!RES
  Top 0.254: U1.15 7.06,11.99 X1.3
!SPI_SEL
  Top 0.254: U1.1 7.68,18.99 7.62,19.05 5.08,19.05 X1.10
F1_1
  Top 0.254: U1.27 25.38,11.2 25.08,11.49 23.62,11.49 22.73,10.54 20.38,10.54 18.29,8.45 17.91,8.45 17.08,7.62 15.88,7.62 15.24,6.99 15.24,5.08 JP6.5
GND  (via drill 0.3)
  Top 0.254: U1.45 28.86,17.49 v28.57,17.78 | U1.38 32.37,13.99 33.02,13.34 33.02,12.83 C16.1 32.44,11.99 U1.34 | U1.6 19.07,16.49 v19.68,15.88 | U1.7 19.57,15.99 v19.68,15.88 | U1.8 19.3,15.49 v19.68,15.88 | U1.9 19.43,14.99 19.68,15.24 | 19.68,15.24 v19.68,15.88 | U1.10 19.57,14.49 | 19.57,14.49 19.68,14.61 | 19.68,14.61 19.68,15.24 | U1.11 19.07,13.99 19.57,14.49 | U1.12 19.2,13.49 19.68,13.97 19.68,14.61 | U1.52 26.38,19.98 v26.67,19.68 | U1.32 27.88,10.73 v27.94,10.79 | U1.26 24.88,10.68 v24.38,10.79 | C21.1 40.77,5.09 v41.91,5.09 43.05,5.09 arc-90 C22.1 | v19.81,21.02 19.84,20.99 U1.64 20.38,21.59 20.7,21.91 21.08,21.91 21.38,21.61 U1.62 | U1.59 22.88,19.62 v22.86,19.62 | U1.3 19.45,17.99 arc90 v19.68,18.22 arc90 19.42,18.49 U1.2 | v20.57,28.07 C2.1 | R3.1 v27.56,36.83 | U1.23 23.38,10.55 23.62,10.79 v24.38,10.79 | U1.25 v24.38,10.79 | 17.79,23.32 v18.8,23.3 | 35.18,10.03 34.29,10.92 v34.29,12.06
  Top 0.305: D5.1 53.02,30.16 | C1.1 56.64,40.77 v56.52,40.64 | v54.28,33.32 55.24,33.15 C4.1 | C7.1 56.64,16.64 v56.52,16.51 | v54.17,7.62 C10.1 | 35.18,10.03 C8.1 | R38.1 v41.91,27.3 | C3.2 v27.94,27.11 | LED1.C 17.79,23.32
  Top 0.61: 53.02,30.16 v53.02,31.37 | v50.16,33.02 50.85,33.02 D4.1 | D3.1 53.7,40.37 v53.98,40.64 | v50.16,43.18 50.85,43.18 D2.1 | D7.1 53.7,16.24 v54.04,16.26 | v50.16,19.05 50.85,19.05 D6.1 | v50.16,8.89 50.85,8.89 D8.1 | D9.1 53.02,6.04 v54.04,6.03 | C9.2 v34.67,17.21 C17.1 | v34.29,12.06 33.78,12.06 C16.1 | C20.1 v43.2,3.17 | Q5.3 v33.02,6.23 | C15.1 v26.67,4.45 | C14.1 v25.4,4.45 | v16.7,15.94 C19.1 | v20.57,24.89 C18.1 | C13.1 30.86,22.16 v31.18,22.48
  Top 0.813: C23.2 14.73,10.16 v14.8,10.22
  pour Bottom: 0,49.53 59.69,49.53 59.69,0 0,0
N$1
  Top 0.254: R3.2 R2.2 29.51,39.5 Q2.3 30.65,40.47 31.75,39.37 31.75,36.98 Q1.1
N$2
  Top 0.305: LED1.A R43.1
N$3
  Top 0.254: R4.2 33.47,37.78 Q1.2 Q2.1
N$6
  Top 0.254: 59.65,45.45 TR1.P$9 | D2.3 51.83,45.21 R5.1
  Top 0.305: D2.3 59.65,45.45
N$7
  Top 0.305: TR1.P$12 59.65,38.37 D3.3 48.5,38.37 R6.1
N$8
  Bottom 0.305: J1.2-4 83.82,33.02 JP3.1
N$9
  Top 0.305: R7.2 C1.2
N$10
  Top 0.305: R7.1 57.78,43.18 | 57.78,43.18 TR1.P$10 | TR1.P$11 58.42,40.64 57.78,41.27 57.78,43.18
N$16
  Top 0.254: R10.1 R11.1 R12.2
N$17
  Top 0.254: D6.3 59.65,21.32 arc90 TR2.P$9
  Top 0.305: D6.3 arc-90 51.83,21.08 R21.1
N$18
  Top 0.305: TR1.P$8 73.66,45.72 74.93,44.45 C5.2 R19.1 78.23,42.67 82.55,46.99 JP3.2
N$19
  Top 0.305: R13.1 48.5,35.29 D4.3 52.34,35.56 R15.2
N$20
  Top 0.254: R16.2 54.85,28.21 D5.3
  Top 0.305: D5.3 51.83,28.45 R14.1
N$21
  Top 0.305: TR1.P$5 73.66,38.1 74.93,39.37 C5.1 R19.2 77.98,41.15 82.55,45.72 87.63,45.72 JP3.6
N$22
  Top 0.305: R15.1 TR1.P$13
N$23
  Top 0.305: R16.1 TR1.P$16
N$24
  Top 0.305: TR1.P$14 C4.2 R17.1 R18.1 TR1.P$15
N$25
  Bottom 0.305: J1.2-5 88.9,34.29 JP3.5
N$26
  Top 0.254: 88.9,41.91 85.09,41.91 78.74,35.56 78.74,32.38 77.47,31.11
  Top 0.305: TR1.P$1 73.66,27.94 74.93,29.21 C6.1 R20.2 76.33,31.11 77.47,31.11 | 88.9,41.91 JP3.7
N$27
  Top 0.305: TR2.P$12 arc90 59.65,14.24 D7.3 48.5,14.24 R22.1
N$30
  Top 0.305: R23.2 C7.2
N$31
  Top 0.305: R23.1 57.78,19.05 | 57.78,19.05 TR2.P$10 | TR2.P$11 58.42,16.51 57.78,17.14 57.78,19.05
N$37
  Top 0.254: R26.1 37.59,12.65 37.52,12.58 38.32,12.58 R28.2
  Top 0.305: R26.1 R27.1
N$38
  Top 0.305: R31.2 52.34,11.43 D8.3 50.02,11.16 R29.1
N$39
  Top 0.305: R32.2 52.34,3.81 D9.3 51.83,4.32 R30.1
N$40
  Top 0.305: TR2.P$13 R31.1
N$41
  Top 0.305: TR2.P$16 R32.1
N$42
  Top 0.305: TR2.P$14 R34.1 C10.2 R33.1 TR2.P$15
N$43
  Top 0.305: TR2.P$8 73.66,21.59 74.93,20.32 C11.2 R35.1 80.52,18.54 82.55,16.51 82.55,11.43 83.82,10.16 87.63,10.16 90.17,7.62 90.17,5.08 JP4.2
N$44  (via drill 0.3)
  Top 0.305: TR2.P$5 73.66,13.97 74.93,15.24 C11.1 R35.2 79.5,17.02 81.28,15.24 v81.28,10.16 | JP4.6 85.09,5.08 v81.28,5.08
  Bottom 0.305: v81.28,5.08 v81.28,10.16
N$45
  Top 0.305: TR2.P$4 73.66,11.43 74.93,10.16 C12.2 R36.1 76.71,8.89 86.36,8.89 JP4.3
N$46
  Top 0.305: TR2.P$1 73.66,3.81 74.93,5.08 C12.1 R36.2 76.71,6.35 JP4.7
N$47
  Top 0.254: R38.2 41.91,24.13 R37.2
  Top 0.305: Q3.1 40.66,22.99 R37.2 | Q4.3 39.2,26.67 40.01,26.67 41.91,24.77 41.91,24.13
N$48
  Top 0.305: Q4.1 38.42,24.3 Q3.2 37.17,23.32 R39.2
N$50
  Top 0.305: TR1.P$4 73.66,35.56 74.93,34.29 C6.2 R20.1 76.2,34.29 JP3.3
N$52
  Bottom 0.254: 90.17,44.45 90.17,45.09 89.53,45.72 87.63,45.72 JP3.4
  Bottom 0.305: J1.2-3 90.17,33.02 90.17,44.45
N$53
  Bottom 0.305: J1.2-6 86.36,33.02 86.36,29.84 87,29.21 88.27,29.21 91.44,32.38 91.44,40.64 93.34,42.55 93.34,45.72 92.08,46.99 JP3.8
N$54
  Bottom 0.305: J1.1-4 88.9,17.78 91.44,15.24 JP4.1
N$55  (via drill 0.3)
  Top 0.305: J1.1-5 86.36,17.78 v86.36,11.43
  Bottom 0.305: v86.36,11.43 JP4.5
N$56
  Bottom 0.305: J1.1-3 88.9,16.51 90.17,15.24 90.17,5.08 JP4.4
N$61
  Bottom 0.305: J1.1-6 83.82,19.05 83.82,8.89 85.09,7.62 85.09,5.08 JP4.8
N$62
  Top 0.254: Q5.1 38.54,8.27 R41.1 41.15,7 C21.2
N$63
  Top 0.254: U1.33 30.93,11.49 R42.1
N$64
  Top 0.305: Q5.4 32.83,3.82 R40.1
NTPWR0+  (via drill 0.61)
  Top 0.61: TR1.P$2 TR1.P$3 v69.85,33.02
  Bottom 0.61: JP1.2 78.74,41.91 v69.85,33.02
NTPWR0-
  Top 0.305: TR1.P$7 71.12,43.18
  Top 0.61: 71.12,43.18 69.85,44.45 69.85,46.35 70.48,46.99 JP1.1 | TR1.P$7 TR1.P$6
NTPWR1+
  Top 0.61: JP2.2 70.48,2.54 69.85,3.17 69.85,5.08 71.12,6.35 TR2.P$2 TR2.P$3
NTPWR1-  (via drill 0.61 pad 0.3)
  Top 0.61: v69.85,16.51 TR2.P$6 | 72.39,16.51 TR2.P$6 | TR2.P$6 TR2.P$7
  Bottom 0.61: JP2.1 78.74,11.43 73.66,16.51 v69.85,16.51
P0_ADJ
  Top 0.254: R17.2 55.88,30.99 55.88,29.84 55.24,29.21 34.29,29.21 28.57,23.5 26.67,23.5 25.38,22.2 U1.54
P0_L_A
  Top 0.254: R11.2 23.88,24.39 | 23.88,24.39 U1.57 | 23.88,24.39 23.88,25.14 R8.2
P0_L_B
  Top 0.254: U1.56 24.38,23.62 R10.2 26.67,25.91 R9.2
P0_R_A
  Top 0.254: U1.58 23.38,24.12 R8.1 C2.2 21.59,26.67 23.5,28.57 26.04,28.57 26.67,27.94 30.48,27.94 33.02,30.48 45.21,30.48 R13.2
P0_R_B
  Top 0.254: U1.55 24.88,22.85 R9.1 C3.1 28.45,24.64 33.66,29.84 49.4,29.84 R14.2
P0_T_A  (via drill 0.3)
  Top 0.254: U1.51 26.88,21.8 27.94,22.86 29.21,22.86 34.73,28.38 v35.94,28.38 | v35.94,31.11 44.83,40.13 R6.2
  Bottom 0.254: v35.94,28.38 v35.94,31.11
P0_T_B  (via drill 0.3)
  Top 0.254: 27.38,20.25 U1.50 27.38,21.47 28.19,22.29 29.91,22.29 v34.92,27.3 | v34.92,31.11 47.5,43.69 R5.2
  Bottom 0.254: v34.92,27.3 v34.92,31.11
P0_VDD_SU  (via drill 0.3)
  Top 0.254: D1.2 33.83,35.05 R4.1 | Q2.2 35.56,38.88 35.56,35.56 35.05,35.05 R4.1 | R4.1 33.85,34.23 v33.85,31.18 | v34.92,26.16 34.61,26.16 31.88,23.43 31.88,21.14 31.5,20.77 28.11,20.77 U1.49
  Bottom 0.254: v33.85,31.18 33.85,27.24 v34.92,26.16
P1_ADJ  (via drill 0.3)
  Top 0.254: U1.43 36.81,16.49 arc90 36.83,16.51 36.83,17.78 37.47,18.41 43.81,18.41 46.99,15.24 v55.88,15.24 | R33.2 55.88,7.11 v55.88,13.34
  Bottom 0.254: v55.88,13.34 v55.88,15.24
P1_L_A
  Top 0.254: R24.2 R27.2 35.56,12.7 33.27,14.99 U1.40
P1_L_B
  Top 0.254: U1.41 35.82,15.49 R25.2
  Top 0.305: R25.2 R26.2
P1_R_A
  Top 0.254: U1.39 33.13,14.49 34.92,12.7 34.92,11.37 35.56,10.73 37.59,10.73 | R24.1 38.23,10.79 46.86,10.79 R29.2
  Top 0.305: C8.2 37.59,10.73 R24.1
P1_R_B
  Top 0.254: U1.42 36.84,15.99 R25.1 44.45,15.24 48.26,11.43 48.26,6.67 R30.2
  Top 0.305: C9.1 R25.1
P1_T_A
  Top 0.254: U1.46 33.23,17.99 34.29,19.05 45.72,19.05 48.26,16.51 R22.2
P1_T_B
  Top 0.254: U1.47 33.09,18.49 34.29,19.68 48.13,19.68 R21.2
P1_VDD_SU
  Top 0.254: Q4.2 39.37,24.62 39.37,22.23 38.1,22.23 37.34,21.46 R39.1 36.7,21.59 33.66,21.59 32.7,22.54 D10.2 32.7,20 31.69,18.99 U1.48
PCM_2M_CLK
  Top 0.254: U1.18 20.88,8.88 19.56,7.56 18.41,7.56 17.78,6.92 17.78,5.08 JP6.7
PCM_4M_CLK
  Top 0.254: U1.19 21.38,8.68 JP6.10
PCM_ALT_FRAME
  Top 0.254: U1.28 25.88,11.33 25.21,11.94 23.43,11.94 22.48,10.99 20.19,10.99 18.1,8.89 17.72,8.89 16.89,8.06 15.68,8.06 JP6.6
PCM_DATA_IO
  Top 0.254: U1.22 22.88,5.1 JP6.11
PCM_DATA_OI
  Top 0.254: U1.21 22.38,7.14 JP6.12
PCM_FRAME
  Top 0.254: U1.20 21.88,8.54 20.32,6.99 20.32,5.08 JP6.9
SPI_CLK
  Top 0.254: U1.63 20.88,20.25 20.32,19.68 6.99,19.68 X1.9
SPI_MISO
  Top 0.254: X1.7 6.64,17.49 U1.4
SPI_MOSI
  Top 0.254: X1.8 5.08,16.51 7.62,16.51 8.1,16.99 U1.5
SYNC_I
  Top 0.254: U1.17 20.38,9.01 19.37,8 18.16,8 JP6.8
SYNC_O
  Top 0.254: JP6.3 12.7,5.08 12.7,6.99 17.2,11.49 U1.16
VCC
  Top 0.254: C17.2 arc-90 31.47,16.99 U1.44 28.23,16.99 28.13,16.89 | C16.2 30.83,13.49 U1.37 28.54,13.49 28.51,13.46 28,13.97 27.94,13.97 26.29,15.62 25.02,15.62 | C18.2 22.38,22.58 U1.60 22.38,20.29 21.78,19.68 | R18.2 53.98,31.62 53.98,32.38 53.07,33.29 D4.2 | Q5.5 35.56,5.72 Q5.2 36.96,9.23 38.36,9.23 39.14,10 R28.1 | U1.29 26.38,8.35 26.67,8.06 C15.2 | U1.24 23.88,8.95 24.57,8.26 25.08,8.26 25.4,7.94 C14.2 | Q3.3 38.84,20.59 D10.3 38.81,20.59 39.37,21.14 41.59,21.14 R37.1 | 19.62,13.02 19.62,12.99 U1.13 16.92,12.99 C19.2 R1.2 | D8.2 53.02,8.06 51.18,6.22 51.18,6.1 52.2,5.08 62.23,5.08 | U1.53 25.88,19.27 25.91,19.24 | D1.3 30.65,33.12 Q1.3 29.51,37.97 R2.1
  Top 0.305: D9.2 53.02,7.98 D8.2 54.85,9.16 R34.2 | D7.2 53.02,18.14 D6.2 53.02,20 53.34,20.32 62.23,20.32 | Q3.3 41.57,21.12 R37.1 | D4.2 51.12,31.39 D5.2 | D3.2 53.02,42.27 D2.2 53.02,44.13 53.34,44.45 62.23,44.45 | 53.07,33.29 53.07,34.02 53.34,34.29 62.23,34.29 | 19.05,27.94 20.45,29.34 R12.1 27.81,33.02 D1.3 | 19.05,27.94 19.05,24.13 19.81,23.37 C18.2 | R43.2 18.86,27.75 19.05,27.94
  Top 0.61: 35.56,5.72 36.83,5.72 38.1,4.46 Q5.6 40.07,3.62 C20.2 40.64,3.06 40.64,1.27 | 19.62,13.02 19.62,12.95 20.13,12.95 21.78,14.61 | 19.62,1.33 19.68,1.27 | 26.42,15.56 26.35,15.62 25.02,15.62 22.8,15.62 21.78,14.61 | 26.42,15.56 28.51,13.46 28.51,11.43 29.02,10.92 29.02,7.11 | 26.42,15.56 26.8,15.56 27.75,16.51 | 27.75,16.51 28.13,16.89 | R37.1 45.59,21.46 46.99,22.86 62.23,22.86 | 21.78,19.68 21.78,14.61 | C13.2 30.73,19.88 28.96,19.88 27.75,18.67 27.75,17.78 | 27.75,17.78 27.75,16.51 | 25.91,19.24 27.75,17.78 | 29.02,7.11 29.02,1.46 29.21,1.27 | 29.02,7.11 C15.2 C14.2
  Top 0.813: 62.23,44.45 62.23,34.29 62.23,22.86 62.23,20.32 62.23,5.08 62.23,1.27 40.64,1.27 29.21,1.27 19.68,1.27 11.43,1.27 JP6.1 7.3,5.4 7.3,9.14 X1.1 C23.1
VCXO_OUT  (via drill 0.3)
  Top 0.254: U1.30 26.88,8.68 27.37,8.19 v28.07,8.19 | v29.97,8.19 30.74,7.42 R40.2
  Bottom 0.254: v28.07,8.19 v29.97,8.19
VCXO_VCTRL
  Top 0.254: C22.2 42.67,7 R41.2
  Top 0.305: C22.2 43.18,6.35 JP5.1

### Text on the board
Top: osmo-xhfc2su-breakout / (C) 2022 Harald Welte
tNames: osmo-xhfc2su-breakout / (C) 2022 Harald Welte | - | + | 1 | + | - | 1